# EAGLE design Mind-Synchronizing-Generator-PinHdrPot-Cinch (EAGLE 7.2.0)
Analoger Wellenmustergenerator mit 3 (trippel-Fünf) 555 Timer.
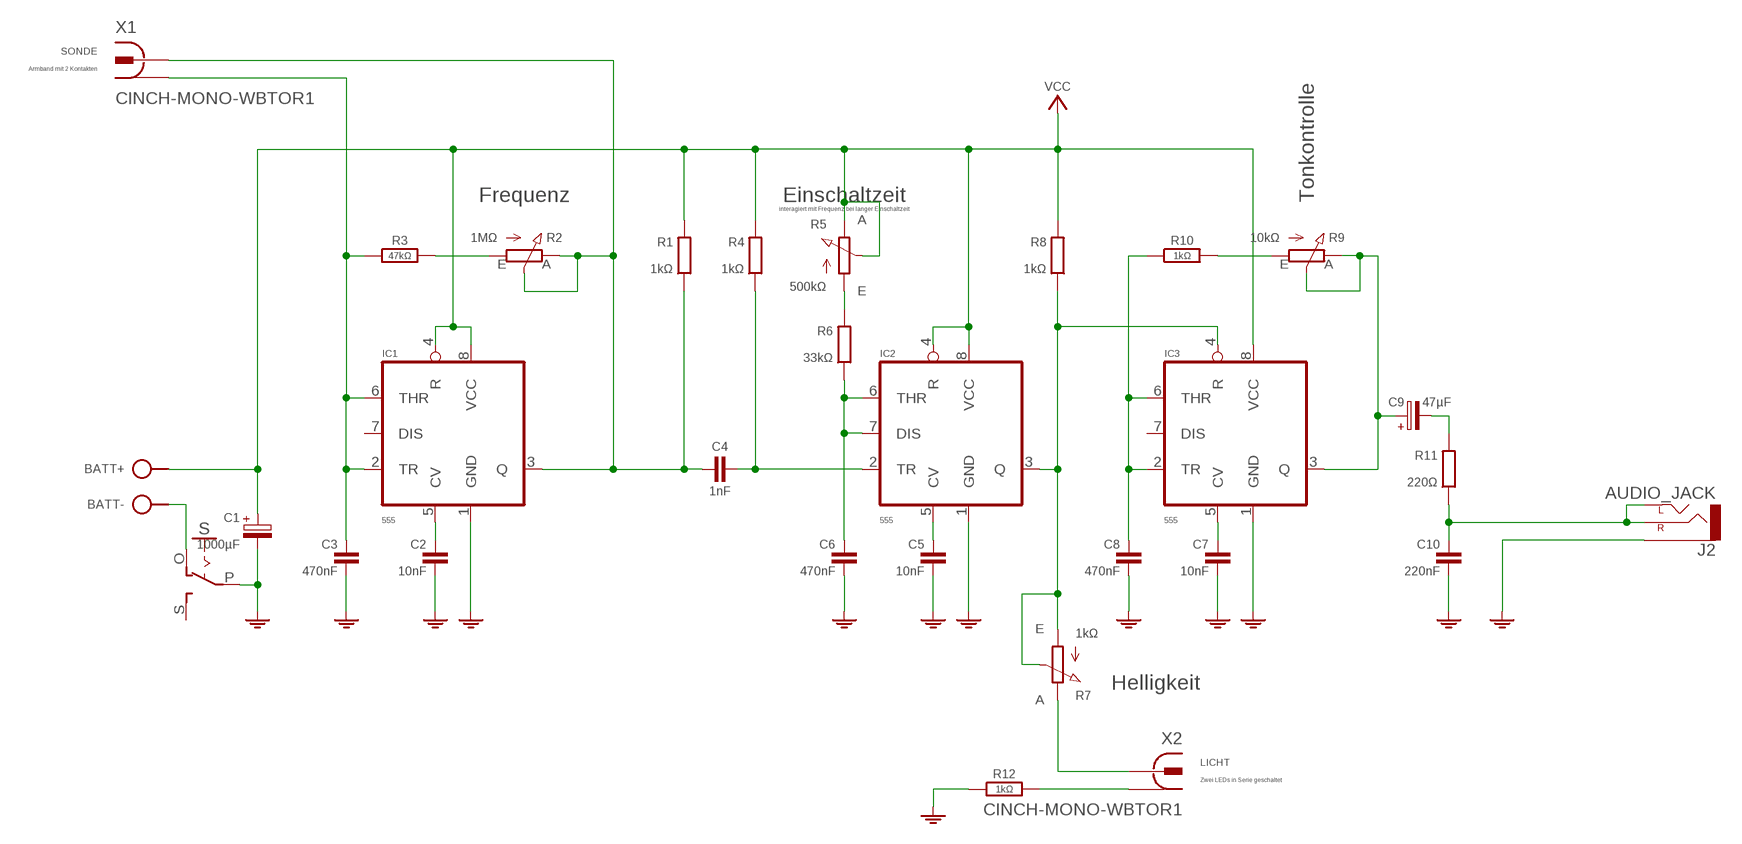
[diagram p0: schematic, sheet 1]

## Parts
BATT  SPAD+--+  [SPAD-+]
C1  1000µF  CPOLE2.5-6  [E2,5-6]
C2  10nF  C050-020X044  [C050-020X044]
C3  470nF  C050-040X075  [C050-040X075]
C4  1nF  C-H050-020X044  [C050-020X044]
C5  10nF  C050-020X044/V  [C050-020X044/V]
C6  470nF  C050-040X075  [C050-040X075]
C7  10nF  C050-020X044/V  [C050-020X044/V]
C8  470nF  C050-040X075  [C050-040X075]
C9  47µF  CPOL-HE2,5-4  [E2,5-4]
C10  220nF  C025-025X060  [C050-025X060]
IC1  555  555_ALT2-LBL  [555-DIL]
IC2  555  555_ALT2-LBL  [555-DIL]
IC3  555  555_ALT2-LBL  [555-DIL]
J2  AUDIO_JACK  [AUDIO-JACK]
R1  1kΩ  R0204/10  [0204/10]
R2  1MΩ  POT-H-3P  [CONN-3P]
R3  47kΩ  R-H0204/10  [0204/10]
R4  1kΩ  R0204/10-V  [0204/10-V]
R5  500kΩ  POT-3P  [CONN-3P]
R6  33kΩ  R0204/10  [0204/10]
R7  1kΩ  POT-3P  [CONN-3P]
R8  1kΩ  R0204/10-V  [0204/10-V]
R9  10kΩ  POT-H-3P  [CONN-3P]
R10  1kΩ  R-H0204/10  [0204/10]
R11  220Ω  R0204/10-V  [0204/10-V]
R12  1kΩ  R-H0204/10  [0204/10]
S  SL-SW-1P-2T-V2  [SLSW-1P2T-V2]
X1  CINCH-MONO-WBTOR1  [WBTOR1]
X2  CINCH-MONO-WBTOR1  [WBTOR1]

## Nets
GND: C1.- C2.2 C3.2 C5.2 C6.2 C7.2 C8.2 C10.2 IC1.1(GND) IC2.1(GND) IC3.1(GND) J2.SLEEVE R12.1 S.P
N$1: C5.1 IC2.5(CV)
N$2: BATT.1 S.O
N$4: R7.3(E) X2.U
N$5: C4.2 IC2.2(TR) R4.2
N$6: C3.1 IC1.2(TR) IC1.6(THR) R3.1 X1.T
N$7: C2.1 IC1.5(CV)
N$8: R5.1(A) R6.1
N$9: C6.1 IC2.6(THR) IC2.7(DIS) R6.2
N$10: R9.1(A) R10.2
N$11: R2.1(A) R3.2
N$12: C8.1 IC3.2(TR) IC3.6(THR) R10.1
N$15: C9.- R11.1
N$16: C10.1 J2.RING(RIGHT) J2.TIP(LEFT) R11.2
N$17: C7.1 IC3.5(CV)
N$18: R12.2 X2.T
Q1: C4.1 IC1.3(Q) R1.2 R2.2(S) R2.3(E) X1.U
Q2: IC2.3(Q) IC3.4(R) R7.1(A) R7.2(S) R8.2
Q3: C9.+ IC3.3(Q) R9.2(S) R9.3(E)
VCC: BATT.2 C1.+ IC1.4(R) IC1.8(VCC) IC2.4(R) IC2.8(VCC) IC3.8(VCC) R1.1 R4.1 R5.2(S) R5.3(E) R8.1
Unconnected: IC1.7(DIS) IC3.7(DIS) S.S

## Notes on the sheet
- SONDE
- Armband mit 2 Kontakten
- Frequenz | Einschaltzeit | Tonkontrolle
- interagiert mit Frequenz bei langer Einschaltzeit
- Helligkeit
- LICHT
- Zwei LEDs in Serie geschaltet

## Library data of the parts
BATT = pad:SPAD+-
C1 = c:CPOL: POLARIZED CAPACITOR, European symbol
C2 C3 C5-C8 C10 = c:C: CAPACITOR, European symbol
C4 = c:C-H
C9 = c:CPOL-H
IC1-IC3 = ic:*555_ALT2
J2 = pad:AUDIO_JACK
R1 R4 R6 R8 R11 = r:R: RESISTOR, European symbol
R2 R9 = r:POT-H
R3 R10 R12 = r:R-H
R5 R7 = r:POT
S = sw:SL-SW-1P-2T
X1 X2 = pad:CINCH-MONO: Lumberg Connectors include con-mfs.lbr - 2001.03.22 Jack connectors - 2005.11.23 http://www.lumberg.de Created by librarian@cadsoft.de

## Board
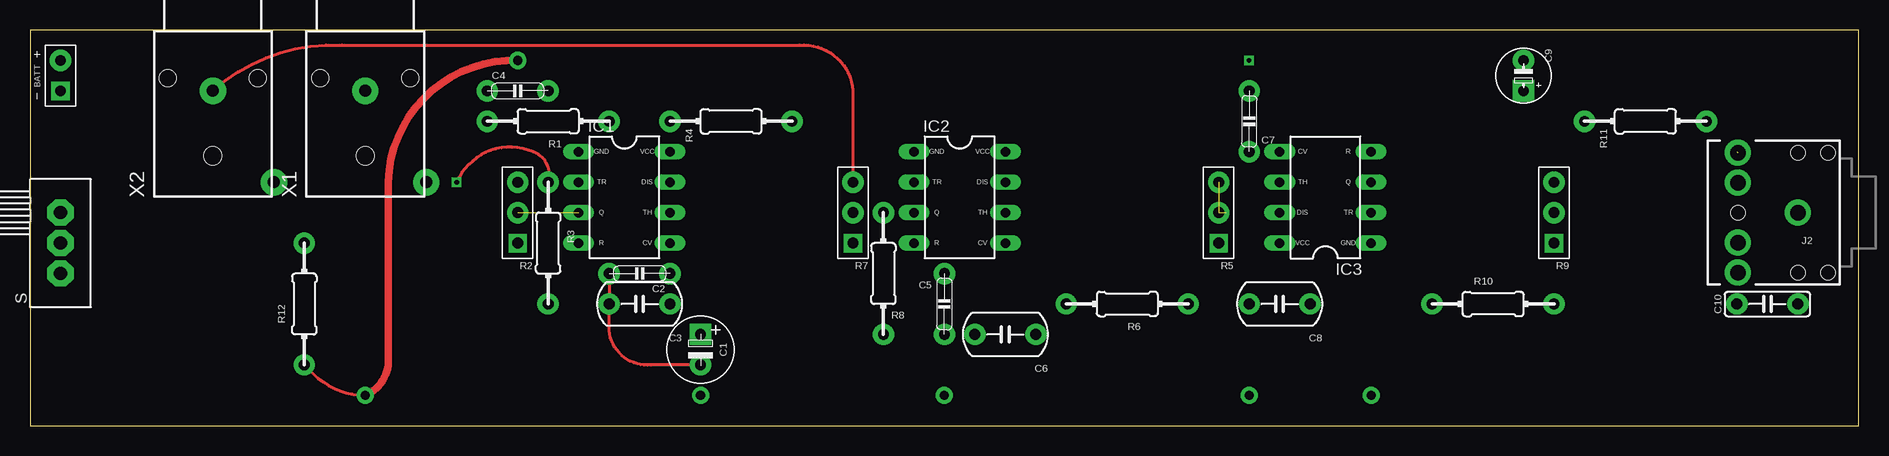
[diagram p1: board, top side]
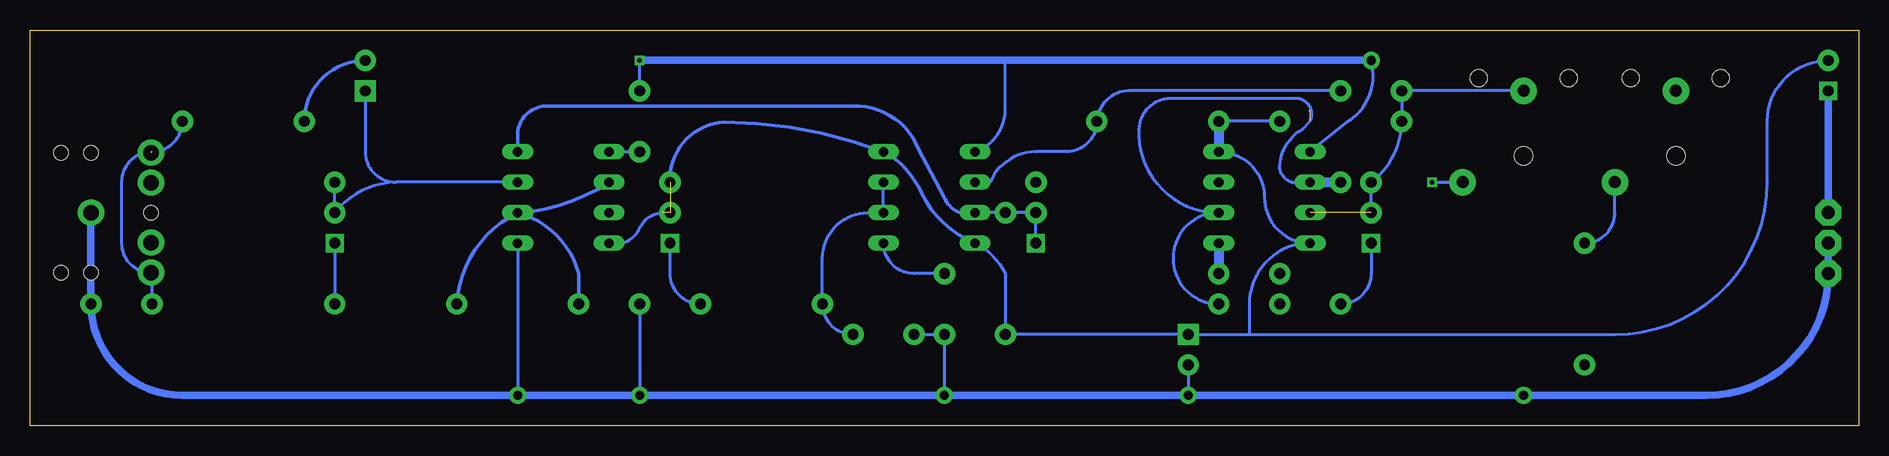
[diagram p2: board, bottom side, seen from below]

Size 152.4 x 33.02 mm. Coordinates in mm from the lower left corner, seen from the top.
Outline: 0,0 152.4,0 152.4,33.02 0,33.02 0,0
Copper layers (1*16): Top 0.035mm / dielectric 1.5mm / Bottom 0.035mm
Design rules "default": minimum track width 10mil, minimum drill 24mil, track to track 8mil, track to pad 8mil, pad to pad 8mil, via to via 8mil, smd to smd 8mil, copper to edge 40mil, drill to drill 8mil, minimum pad ring 10mil, minimum via ring 8mil, stop-mask expansion 4mil, vias tented up to drill 0mil, thermal gap 10mil

### Footprints (pad centres in the part's own frame; a part is rotated, then mirrored left to right if it is on the bottom)
SPAD-+ = drill 0.9 pad 1.524 square: 1 0,-1.27 | drill 0.9 pad 1.778: 2 0,1.27
E2,5-6 = drill 0.9 pad 1.778 square: + -1.27,0 | drill 0.9 pad 1.778: - 1.27,0
C050-020X044 = drill 0.9 pad 1.778: 1 -2.54,0; 2 2.54,0
C050-040X075 = drill 0.9 pad 1.778: 1 -2.54,0; 2 2.54,0
C050-020X044/V = drill 0.9 pad 1.778: 1 0,2.54; 2 0,-2.54
E2,5-4 = drill 0.9 pad 1.778 square: + 1.27,0 | drill 0.9 pad 1.778: - -1.27,0
C050-025X060 = drill 0.9 pad 1.778: 1 0,2.54; 2 0,-2.54
555-DIL = drill 0.8 pad 1.27 long: 1 -3.81,3.81; 2 -3.81,1.27; 3 -3.81,-1.27; 4 -3.81,-3.81; 5 3.81,-3.81; 6 3.81,-1.27; 7 3.81,1.27; 8 3.81,3.81
AUDIO-JACK = drill 1.3 pad 2.184: RING 5,5; RSH 5,2.5; SLEEVE 0,0; TIP 5,-5; TSH 5,-2.5 | hole 1.2: 0,5; -2.5,5; -2.5,-5; 0,-5; 5,0
0204/10 = drill 0.9 pad 1.778: 1 -5.08,0; 2 5.08,0
CONN-3P = drill 0.9 pad 1.524 square: 1 0,2.54 | drill 0.9 pad 1.778: 2 0,0; 3 0,-2.54
0204/10-V = drill 0.9 pad 1.778: 1 0,5.08; 2 0,-5.08
SLSW-1P2T-V2 = drill 1.1 pad 2.184 octagon: O 0,2.54; P 0,0; S 0,-2.54
WBTOR1 = drill 1 pad 2.2: T 5.08,-7.62; U 0,0 | hole 1.4: -3.75,1.08; 3.75,1.08 | hole 1.5: 0,-5.42

### Placement (x,y rotation side)
BATT  2.54,29.21 0 top
C1  55.88,6.35 270 top
C2  50.8,12.7 180 top
C3  50.8,10.16 180 top
C4  40.64,27.94 0 top
C5  76.2,10.16 0 top
C6  81.28,7.62 180 top
C7  101.6,25.4 180 top
C8  104.14,10.16 180 top
C9  124.46,29.21 270 top
C10  144.78,10.16 90 top
IC1  49.53,19.05 0 top
IC2  77.47,19.05 0 top
IC3  107.95,19.05 180 top
J2  147.32,17.78 180 top
R1  43.18,25.4 180 top
R2  40.64,17.78 180 top
R3  43.18,15.24 270 top
R4  58.42,25.4 90 top
R5  99.06,17.78 180 top
R6  91.44,10.16 180 top
R7  68.58,17.78 180 top
R8  71.12,12.7 180 top
R9  127,17.78 180 top
R10  121.92,10.16 0 top
R11  134.62,25.4 90 top
R12  22.86,10.16 90 top
S  2.54,15.24 0 top
X1  27.94,27.94 0 top
X2  15.24,27.94 0 top

### Tracks (layer width: path | path; a pad name or v marks a point on that pad's centre or on a via)
GND  (via drill 0.38, 0.76, 0.76 pad 1.42)
  Top 0.254: R12.1 23.6,4.34 arc45 v27.94,2.54 | C2.2 C3.2 48.26,7.94 arc90 51.75,5.08 C1.-
  Top 0.61: v40.64,30.48 arc90 29.84,20.32 29.84,5.08 arc-61 v27.94,2.54
  Bottom 0.254: C1.- v55.88,2.54 | IC3.1 v111.76,2.54 | C8.2 v101.6,2.54 | v76.2,2.54 C5.2 C6.2 | C7.2 v101.6,30.48 | IC1.1 42.55,25.4 arc-73 v40.64,30.48 | IC2.1 arc-70 71.12,26.35 71.12,30.48
  Bottom 0.61: J2.SLEEVE C10.2 arc-90 139.7,2.54 v111.76,2.54 v101.6,2.54 v76.2,2.54 v55.88,2.54 v27.94,2.54 12.7,2.54 arc-90 2.54,12.7 S.P | v101.6,30.48 71.12,30.48 v40.64,30.48
N$1
  Bottom 0.254: C5.1 78.74,12.7 arc90 IC2.5
N$2
  Bottom 0.61: BATT.1 S.O
N$4
  Top 0.254: 15.58,28.28 X2.U arc-45 25.98,31.75 64.14,31.75 arc-90 68.58,27.94 R7.3
N$5
  Bottom 0.254: C4.2 60.64,27.94 arc-90 R4.2 arc90 66.04,22.86 68.58,22.86 arc-67 72.39,20.32 IC2.2
N$6  (via drill 0.38)  (1 unrouted)
  Top 0.254: R3.1 arc90 41.91,22.86 arc90 v35.56,20.32
  Bottom 0.254: IC1.2 46.35,20.32 arc106 48.26,21.59 arc57 46.35,24.77 45.72,25.4 arc-120 46.99,27.3 57.15,27.3 arc-90 60.01,24.77 arc-90 53.66,17.78 IC1.6 arc-90 57.15,13.97 arc-90 C3.1 | 45.72,26.3 45.72,26.35 | v35.56,20.32 X1.T
  Bottom 0.813: IC1.2 R3.1
N$7
  Bottom 0.813: IC1.5 C2.1
N$8
  Bottom 0.254: R6.1 arc90 99.06,12.7 R5.1
N$9
  Bottom 0.254: C6.1 arc90 R6.2 86.36,13.97 arc90 82.55,17.78 IC2.6 IC2.7
N$10
  Bottom 0.254: R9.1 R10.2
N$11
  Bottom 0.254: R2.1 40.64,12.7 arc90 R3.2
N$12
  Bottom 0.305: IC3.2 arc-30 IC3.6 | C8.1 106.68,12.7 arc-60 IC3.2 | R10.1 arc60 IC3.2
N$15
  Bottom 0.305: R11.1 arc90 C9.-
N$16  (1 unrouted)
  Bottom 0.254: R11.2 arc90 142.24,22.86 arc-90 144.78,20.32 144.78,15.24 arc-90 J2.RING 142.24,12.78 C10.1
N$17
  Bottom 0.254: IC3.5 C7.1
N$18
  Bottom 0.254: R12.2 arc-90 20.32,17.78 X2.T
Q1  (1 unrouted)
  Bottom 0.254: X1.U C4.1 R1.2 arc37 39.37,21.59 arc16 R2.3 R2.2
Q2
  Bottom 0.254: R7.1 R7.2 R8.2 73.34,17.78
  Bottom 0.305: IC3.4 111.76,24.38 arc90 109.22,26.67 83.82,26.67 arc70 78.36,23.11 76.2,19.05 arc-90 73.34,17.78 IC2.3
Q3
  Bottom 0.254: IC3.3 121.92,20.32 | 121.92,20.32 arc-50 R9.2 R9.3 | C9.+ 124.46,22.86 arc-90 121.92,20.32
VCC  (2 unrouted)
  Bottom 0.254: R1.1 R4.1 | IC2.4 arc37 71.12,12.7 R8.1 C1.+ 50.8,7.62 | IC3.8 103.19,15.24 arc-60 101.6,16.51 arc60 99.69,17.78 | IC1.8 arc90 49.53,19.05 arc-90 IC1.4 arc-90 50.8,10.16 50.8,7.62 | 50.8,7.62 20.32,7.62 arc-90 7.62,20.32 7.62,25.4 arc90 BATT.2
  Bottom 0.305: R5.3 arc90 94.55,25.34 arc20 IC2.8 arc40 78.11,19.37 arc-40 IC2.4
  Bottom 0.813: R4.1 IC1.8